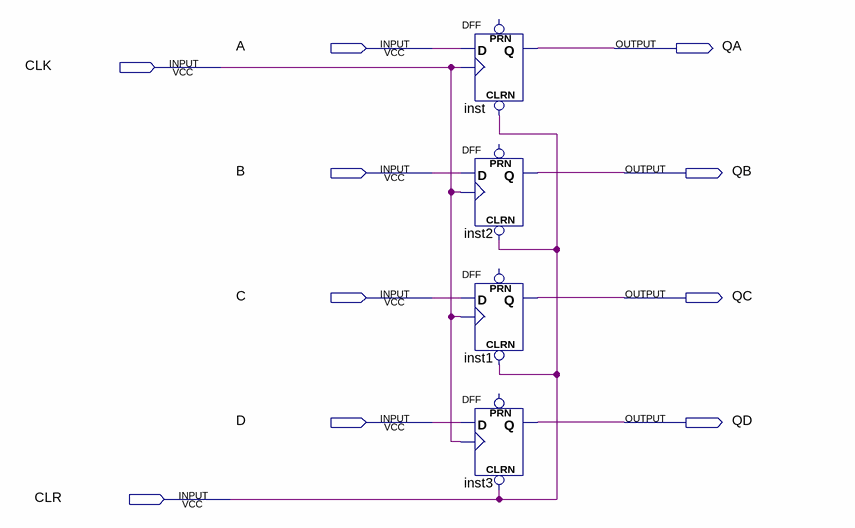
[diagram p0: schematic sheet]
// Quartus schematic 4-bit Register.bdf as structural Verilog: 4 symbols, 10 pins
module \4-bit_Register  (
  input  A,
  input  CLK,
  input  B,
  input  C,
  input  D,
  input  CLR,
  output QA,
  output QB,
  output QC,
  output QD
);

  DFF inst (.CLRN(CLR), .CLK(CLK), .D(A), .Q(QA));  // open: PRN
  DFF inst2 (.CLRN(CLR), .CLK(CLK), .D(B), .Q(QB));  // open: PRN
  DFF inst1 (.CLRN(CLR), .CLK(CLK), .D(C), .Q(QC));  // open: PRN
  DFF inst3 (.CLRN(CLR), .CLK(CLK), .D(D), .Q(QD));  // open: PRN
endmodule
